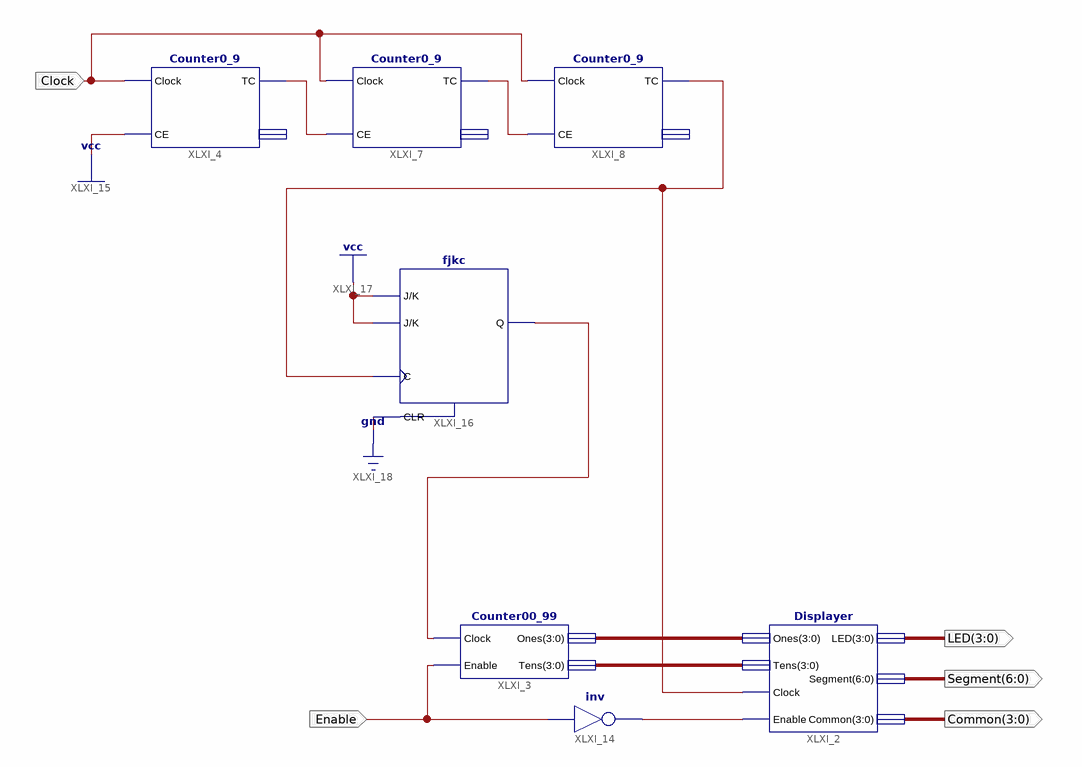
[diagram p0: schematic sheet 1]
// Xilinx ISE schematic VirtualDice.sch (spartan6) as structural Verilog: 7 symbols, 5 ports
module VirtualDice (
  input  Enable,
  input  Clock,
  output [3:0] LED,
  output [6:0] Segment,
  output [3:0] Common
);

  wire XLXN_21, XLXN_27, XLXN_28, XLXN_38, XLXN_49;
  wire [3:0] XLXN_1, XLXN_2;

  Counter0_9 XLXI_4 (.Clock(Clock), .CE(1'b1), .TC(XLXN_27));  // open: Count
  Displayer XLXI_2 (
    .Ones(XLXN_1), .Tens(XLXN_2), .Clock(XLXN_49), .Enable(XLXN_21), .LED(LED), .Segment(Segment),
    .Common(Common));
  Counter00_99 XLXI_3 (.Clock(XLXN_38), .Enable(Enable), .Ones(XLXN_1), .Tens(XLXN_2));
  Counter0_9 XLXI_7 (.Clock(Clock), .CE(XLXN_27), .TC(XLXN_28));  // open: Count
  Counter0_9 XLXI_8 (.Clock(Clock), .CE(XLXN_28), .TC(XLXN_49));  // open: Count
  not XLXI_14 (XLXN_21, Enable);
  fjkc XLXI_16 (.C(XLXN_49), .CLR(1'b0), .J(1'b1), .K(1'b1), .Q(XLXN_38));
endmodule
